# EasyEDA Pro project easy_eda_project.epro

# Schematic Schematic1
Board Name: Board1; Create Date: 2025-12-13; Page Name: P1; Project Name: Relay; Schematic Name: Schematic1; Update Date: 2025-12-13; Company: EasyEDA.com; Page Size: A4; Version: V1.0
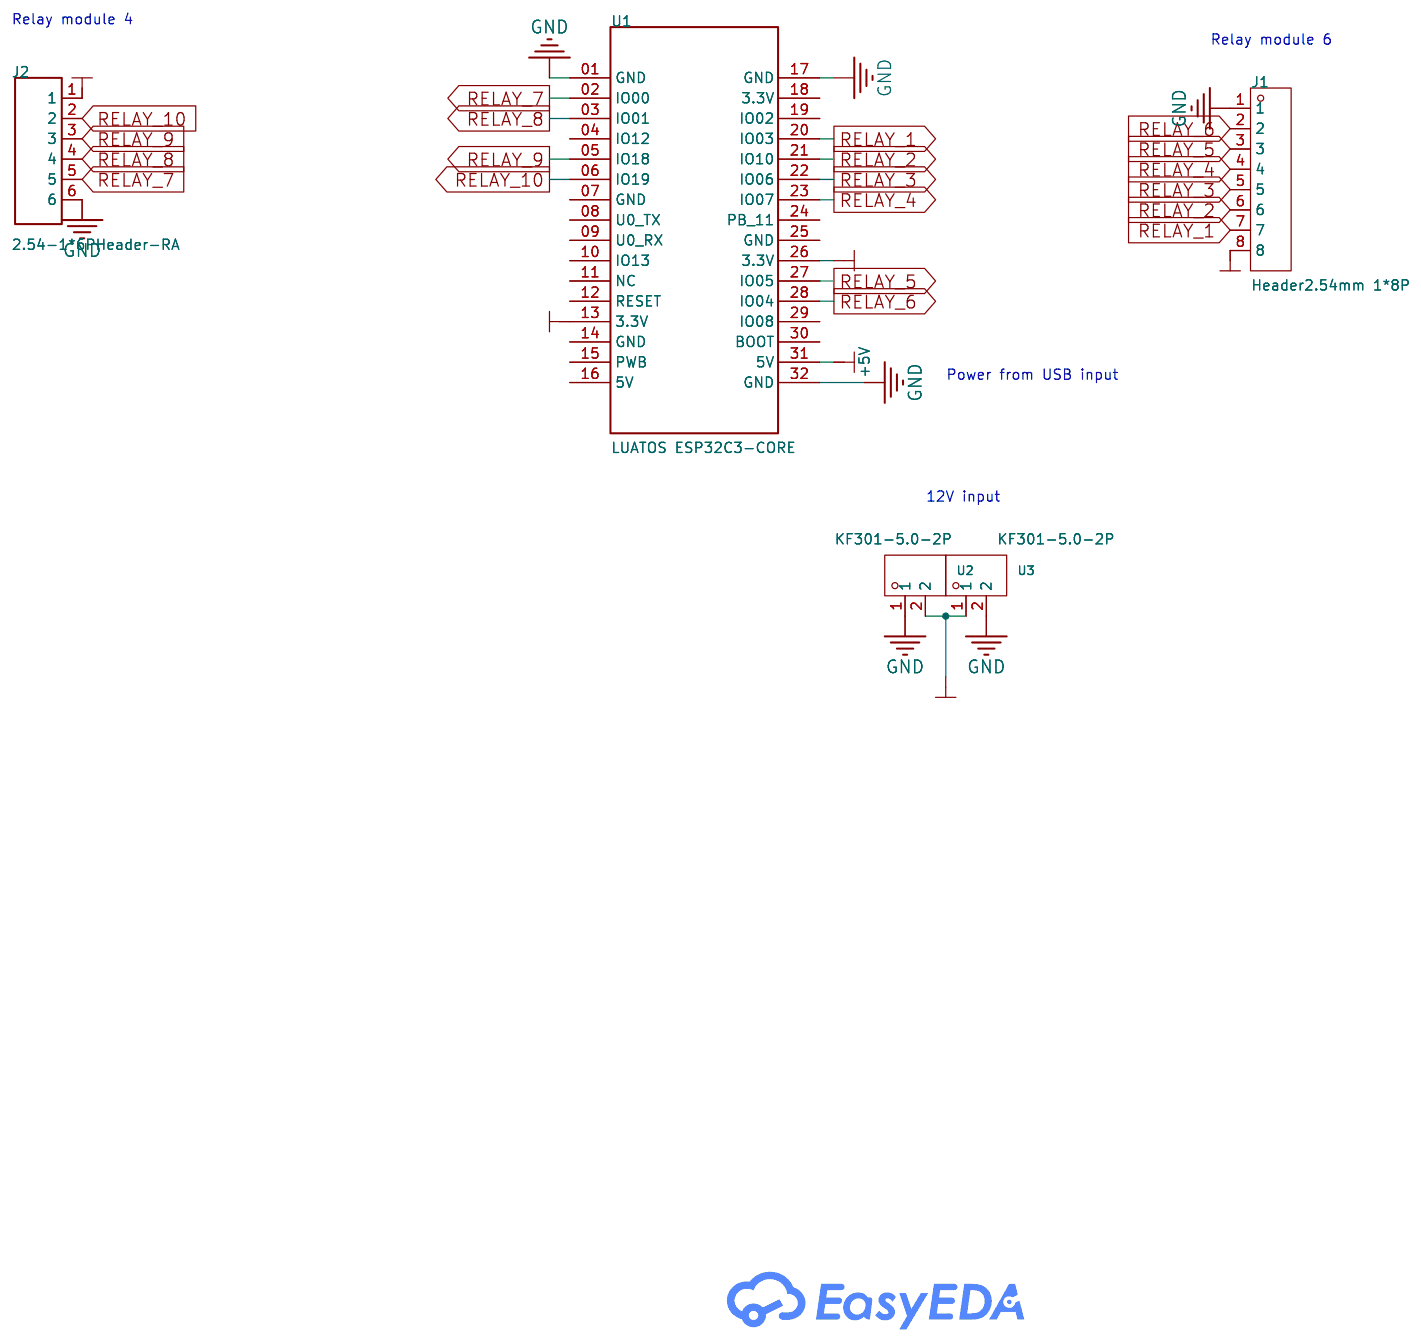
[diagram p0: schematic sheet]

## Parts
J1  Header2.54mm 1*8P  [HDR-TH_8P-P2.54-H-M-W10.0]
J2  2.54-1*6PHeader-RA  [HDR-TH_6P-P2.54-H-M-W10.0]
U1  LUATOS ESP32C3-CORE  [LUATOS ESP32C3-CORE]
U2  KF301-5.0-2P  [CONN-TH_P5.00_KF301-5.0-2P]
U3  KF301-5.0-2P  [CONN-TH_P5.00_KF301-5.0-2P]

## Library data of the parts
J1 = Header2.54mm 1*8P: Supplier Part: C49256; Supplier: LCSC; Manufacturer: ReliaPro
J2 = 2.54-1*6PHeader-RA: Supplier: LCSC; Manufacturer: BOOMELE(博穆精密); Manufacturer Part: 2.54-1*6P反弯排针; Supplier Part: C56816; JLCPCB Part Class: Extended Part
U1 = LUATOS ESP32C3-CORE: Manufacturer: LuatOS; Manufacturer Part: ESP32C3-CORE; link: https://wiki.luatos.com/chips/esp32c3/board.html
U2 U3 = KF301-5.0-2P: Structure:1x2P Pitch:5mm Color:Blue Mounting Style:Straight Current Rating (Max):17A Voltage Rating (Max):250V Number of Pins:2P Number of Rows:1 Wire Gauge - AWG:14~22 Wire Gauge - AWG:14~22 Wire Gauge - mm2:1.5 Wire Gauge - mm2:1.5 Number of PINs Per Ro; LCSC Part Name: 5mm 1x2P 排数:1 每排P数:2 直插; Supplier Part: C474881; Manufacturer: KEFA(科发); Supplier Footprint: 插件,P=5mm; JLCPCB Part Class: Extended Part; Datasheet: https://atta.szlcsc.com/upload/public/pdf/source/20230317/03A5B5FC229D6F9225E8F51DA1A4E80A.pdf; Supplier: LCSC; Structure: 1x2P; Pitch: 5mm; Color: Blue; Mounting Style: Straight; Current Rating (Max): 17A; Voltage Rating (Max): 250V; Number of Pins: 2P; Number of Rows: 1; Wire Gauge - AWG: 14~22; Wire Gauge - mm2: 1.5; Number of PINs Per Row: 2; Operating Temperature Range: -30℃~+120℃

## Nets
+5V: U1.31(5V)
+12V: U2.2 U3.1
GND: J1.1 J2.6 U1.01(GND) U1.17(GND) U1.32(GND) U2.1 U3.2
VCC_3.3: J1.8 J2.1 U1.13(3.3V) U1.26(3.3V)
RELAY_1: J1.7 U1.20(IO03)
RELAY_2: J1.6 U1.21(IO10)
RELAY_3: J1.5 U1.22(IO06)
RELAY_4: J1.4 U1.23(IO07)
RELAY_5: J1.3 U1.27(IO05)
RELAY_6: J1.2 U1.28(IO04)
RELAY_7: J2.5 U1.02(IO00)
RELAY_8: J2.4 U1.03(IO01)
RELAY_9: J2.3 U1.05(IO18)
RELAY_10: J2.2 U1.06(IO19)

Not connected (* = marked no-connect by the designer): U1 04(IO12) 07(GND) 08(U0_TX) 09(U0_RX) 10(IO13) 11(NC) 12(RESET) 14(GND) 15(PWB) 16(5V) 18(3.3V) 19(IO02) 24(PB_11) 25(GND) 29(IO08) 30(BOOT)

## Notes on the sheet
- Relay module 4
- Relay module 6
- Power from USB input
- 12V input

# Board PCB1
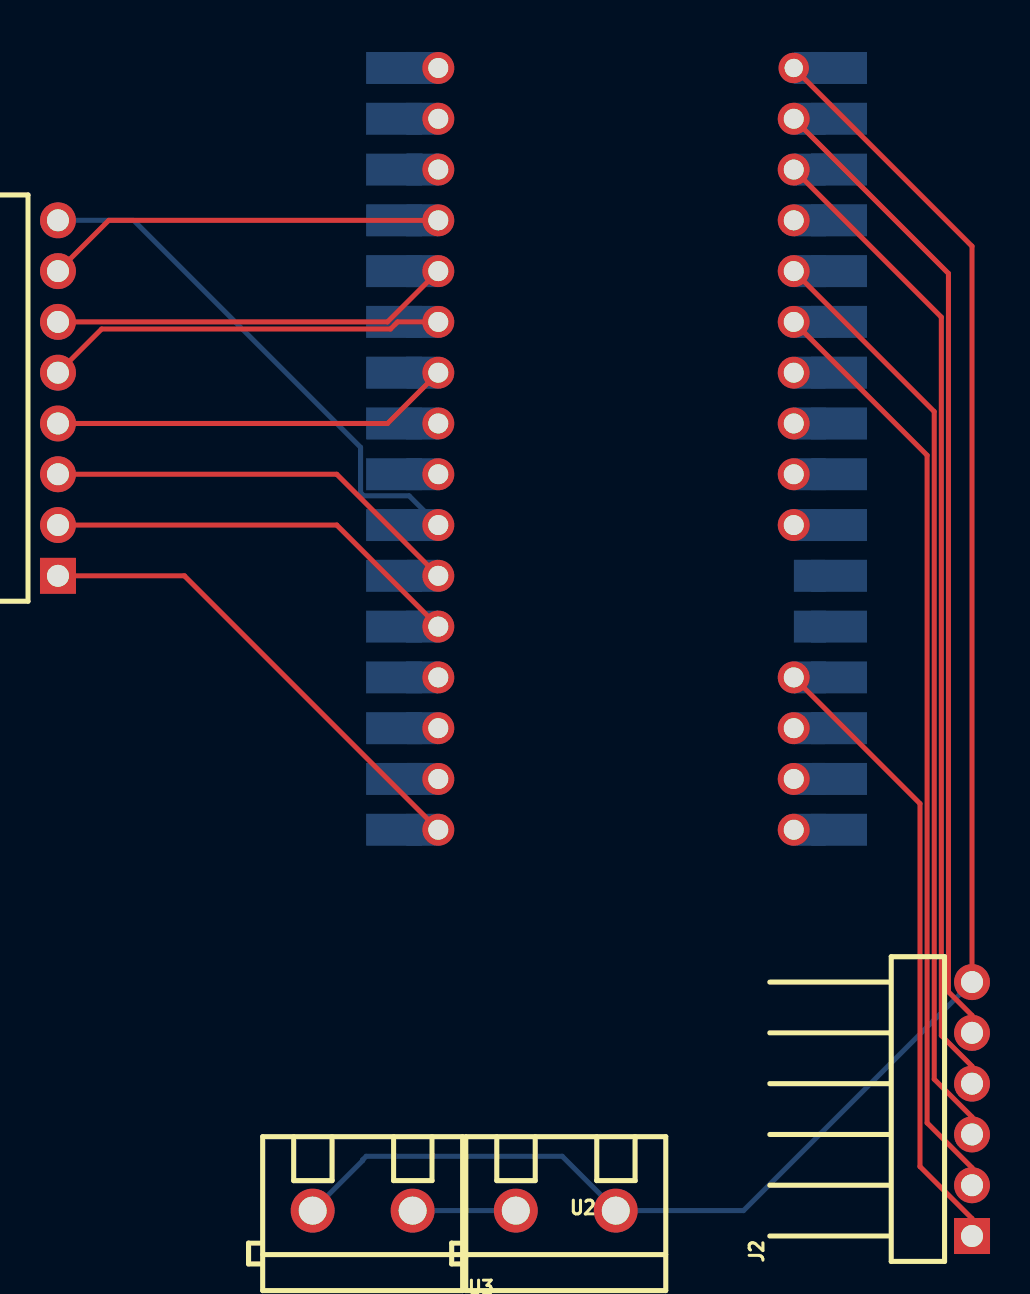
[diagram p1: board, top side]
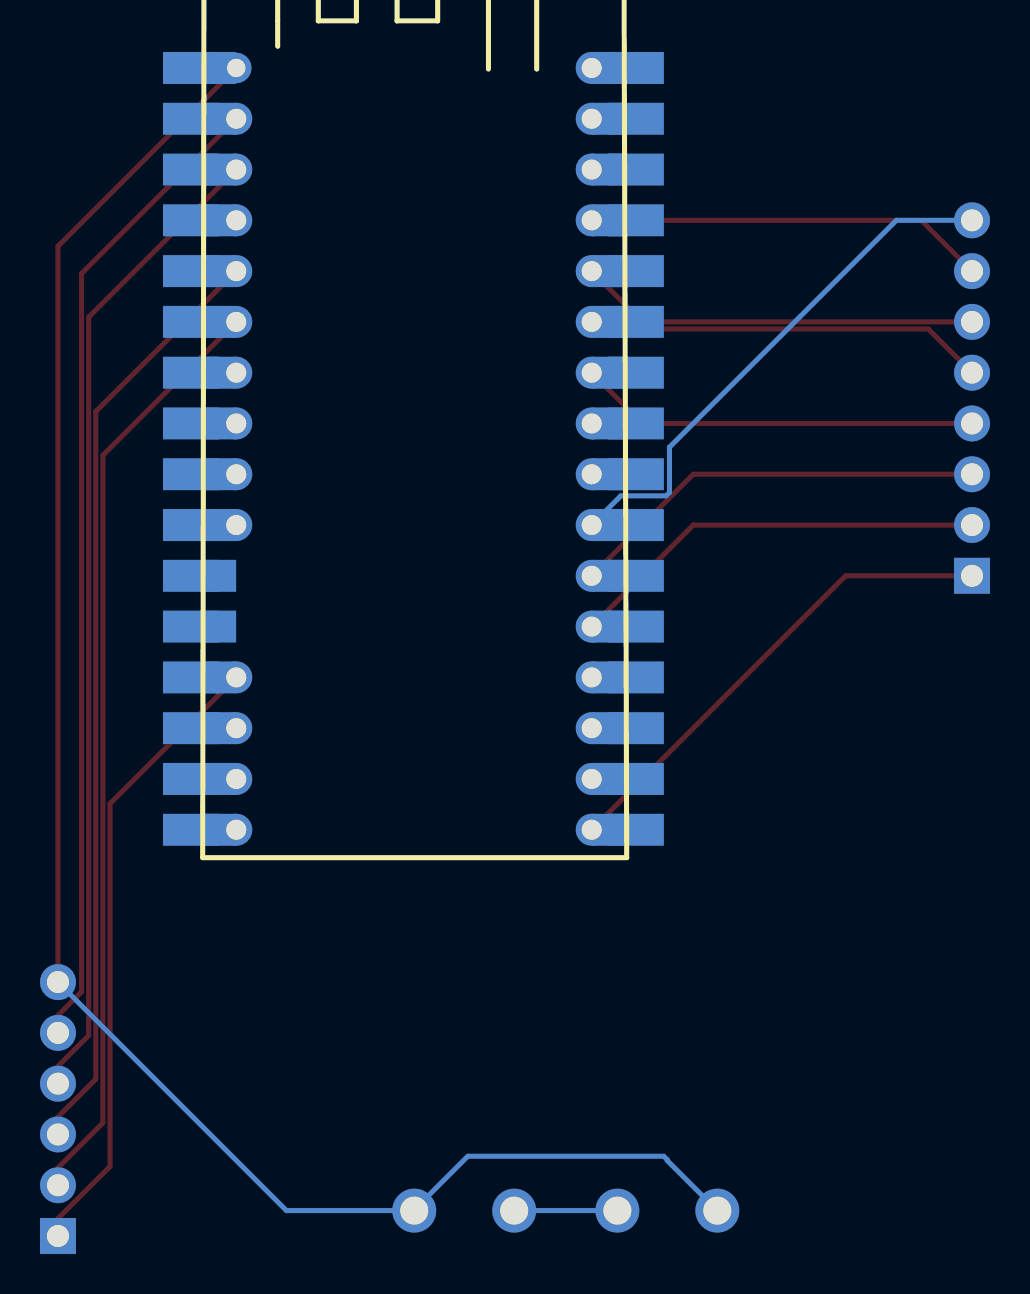
[diagram p2: board, bottom side, seen from below]

No outline. copper layers: Top Layer, Bottom Layer. Coordinates in mm from the lowest, leftmost part position.
Stack: Top Layer 0.035mm / Dielectric1 1.51mm FR4 er 4.5 / Bottom Layer 0.035mm

## Design rules (mm)
template: JLCPCB Capability(Two Layers Board)
spacing copperThickness1oz (default): track to track 0.102, other pairs 0.152 to 0.3
spacing copperThickness2oz: track to track 0.203, other pairs 0.152 to 0.3
track width copperThickness1oz (default): min 0.127, default 0.254, max 2.54
track width copperThickness2oz: min 0.203, default 0.254, max 2.54
differential pair differentialPair (default): width min 0.127, default 0.254, max 2.54; gap min 0.152, default 0.152
via viaSize (default): diameter min 0.5, default 0.61, max 10; hole min 0.3, default 0.305, max 6.3

## Placement (name value [footprint] x y rotation side)
J1  Header2.54mm 1*8P  [HDR-TH_8P-P2.54-H-M-W10.0]  0 40.64 90 top
J2  2.54-1*6PHeader-RA  [HDR-TH_6P-P2.54-H-M-W10.0]  45.72 5.08 90 top
U1  -  [LUATOS ESP32C3-CORE]  27.94 38.1 180 bottom
U2  KF301-5.0-2P  [CONN-TH_P5.00_KF301-5.0-2P]  25.4 0 180 top
U3  KF301-5.0-2P  [CONN-TH_P5.00_KF301-5.0-2P]  15.24 0 180 top

## Footprints (pads in the part's own frame, mm; a bottom-side part is the same pattern mirrored in y, then rotated)
CONN-TH_P5.00_KF301-5.0-2P
  round 2.2 hole 1.4: 1(-2.5,0) 2(2.5,0)
HDR-TH_6P-P2.54-H-M-W10.0
  rect 1.8x1.8 hole 1.1: 1(-6.35,0)
  round 1.8 hole 1.1: 2(-3.81,0) 3(-1.27,0) 4(1.27,0) 5(3.81,0) 6(6.35,0)
HDR-TH_8P-P2.54-H-M-W10.0
  rect 1.8x1.8 hole 1.1: 1(-8.89,0)
  round 1.8 hole 1.1: 2(-6.35,0) 3(-3.81,0) 4(-1.27,0) 5(1.27,0) 6(3.81,0) 7(6.35,0) 8(8.89,0)
LUATOS ESP32C3-CORE
  rect 2.8x1.6 smd: 01(-11.127,19.05) 02(-11.127,16.51) 03(-11.127,13.97) 04(-11.127,11.43) 05(-11.127,8.89) 06(-11.127,6.35) 07(-11.127,3.81) 08(-11.127,1.27) 09(-11.127,-1.27) 10(-11.127,-3.81) 11(-11.127,-6.35) 12(-11.127,-8.89) 13(-11.127,-11.43) 14(-11.127,-13.97) 15(-11.127,-16.51) 16(-11.127,-19.05) 17(11.127,19.05) 18(11.127,16.51) 19(11.127,13.97) 20(11.127,11.43) 21(11.127,8.89) 22(11.127,6.35) 23(11.127,3.81) 24(11.127,1.27) 25(11.127,-1.27) 26(11.127,-3.81) 27(11.127,-6.35) 28(11.127,-8.89) 29(11.127,-11.43) 30(11.127,-13.97) 31(11.127,-16.51) 32(11.127,-19.05)
  rect 1.6x1.6 smd: 01(-9.668,19.05) 02(-9.668,16.51) 03(-9.668,13.97) 04(-9.668,11.43) 05(-9.668,8.89) 06(-9.668,6.35) 07(-9.668,3.81) 08(-9.668,1.27) 09(-9.668,-1.27) 10(-9.668,-3.81) 11(-9.668,-6.35) 12(-9.668,-8.89) 13(-9.668,-11.43) 14(-9.668,-13.97) 15(-9.668,-16.51) 16(-9.668,-19.05) 17(9.722,19.05) 18(9.722,16.51) 19(9.722,13.97) 20(9.722,11.43) 21(9.722,8.89) 22(9.722,6.35) 23(9.722,3.81) 24(9.722,1.27) 25(9.722,-1.27) 26(9.722,-3.81) 27(9.722,-6.35) 28(9.722,-8.89) 29(9.722,-11.43) 30(9.722,-13.97) 31(9.722,-16.51) 32(9.722,-19.05)
  round 1.524 hole 0.914: 01(-8.863,19.05)
  round 1.6 hole 1: 02(-8.863,16.51) 03(-8.863,13.97) 04(-8.863,11.43) 05(-8.863,8.89) 06(-8.863,6.35) 07(-8.863,3.81) 08(-8.863,1.27) 09(-8.863,-1.27) 10(-8.863,-3.81) 13(-8.863,-11.43) 14(-8.863,-13.97) 15(-8.863,-16.51) 16(-8.863,-19.05) 17(8.917,19.05) 18(8.917,16.51) 19(8.917,13.97) 20(8.917,11.43) 21(8.917,8.89) 22(8.917,6.35) 23(8.917,3.81) 24(8.917,1.27) 25(8.917,-1.27) 26(8.917,-3.81) 27(8.917,-6.35) 28(8.917,-8.89) 29(8.917,-11.43) 30(8.917,-13.97) 31(8.917,-16.51) 32(8.917,-19.05)

## Nets
As in the schematic.

Pads without a net: U1 04 07 08 09 10 11 12 14 15 16 18 19 24 25 29 30

## Routing (per net, layer and track width the routed paths; a pad name or vN(x,y) marks a point on that pad's centre or on a via; arc(x,y) is an arc through that point)
+12V: length 5.2
  Bottom Layer w0.254: U2.2 U3.1
GND: length 113.7
  Top Layer w0.254: U1.01 45.72,48.23 J2.6 ; J1.1 6.32,31.75 U1.32
  Bottom Layer w0.254: J2.6 34.29,0 U2.1 27.9,0.04 25.22,2.72 15.42,2.72 15.24,2.54 15.24,2.5 U3.2
VCC_3.3: length 58.3
  Top Layer w0.254: J2.1 45.72,-0.4 43.12,2.21 43.12,20.36 U1.13
  Bottom Layer w0.254: U1.26 17.56,35.75 15.3,35.75 15.13,35.91 15.13,38.18 3.78,49.53 J1.8
RELAY_1: length 20.1
  Top Layer w0.254: J1.7 2.54,49.53 U1.20
RELAY_2: length 20.1
  Top Layer w0.254: U1.21 16.48,44.45 J1.6
RELAY_3: length 20.1
  Top Layer w0.254: J1.5 2.18,44.09 16.63,44.09 16.99,44.45 U1.22
RELAY_4: length 20.1
  Top Layer w0.254: U1.23 16.48,39.37 J1.4
RELAY_5: length 21.1
  Top Layer w0.254: U1.27 13.94,36.83 J1.3
RELAY_6: length 21.1
  Top Layer w0.254: J1.2 13.94,34.29 U1.28
RELAY_7: length 49.4
  Top Layer w0.254: U1.02 44.54,46.87 44.54,10.94 45.72,9.76 J2.5
RELAY_8: length 49.4
  Top Layer w0.254: U1.03 44.19,44.69 44.19,8.76 45.72,7.22 J2.4
RELAY_9: length 46.9
  Top Layer w0.254: J2.3 45.72,4.68 43.83,6.57 43.83,39.96 U1.05
RELAY_10: length 46.9
  Top Layer w0.254: J2.2 45.72,2.14 43.47,4.39 43.47,37.78 U1.06

## Text on the board
Top Layer: Relay module 6 | 12V input and power for modules | Relay module 4
